# EAGLE design HeaterMeterPI (EAGLE 6.6.0)
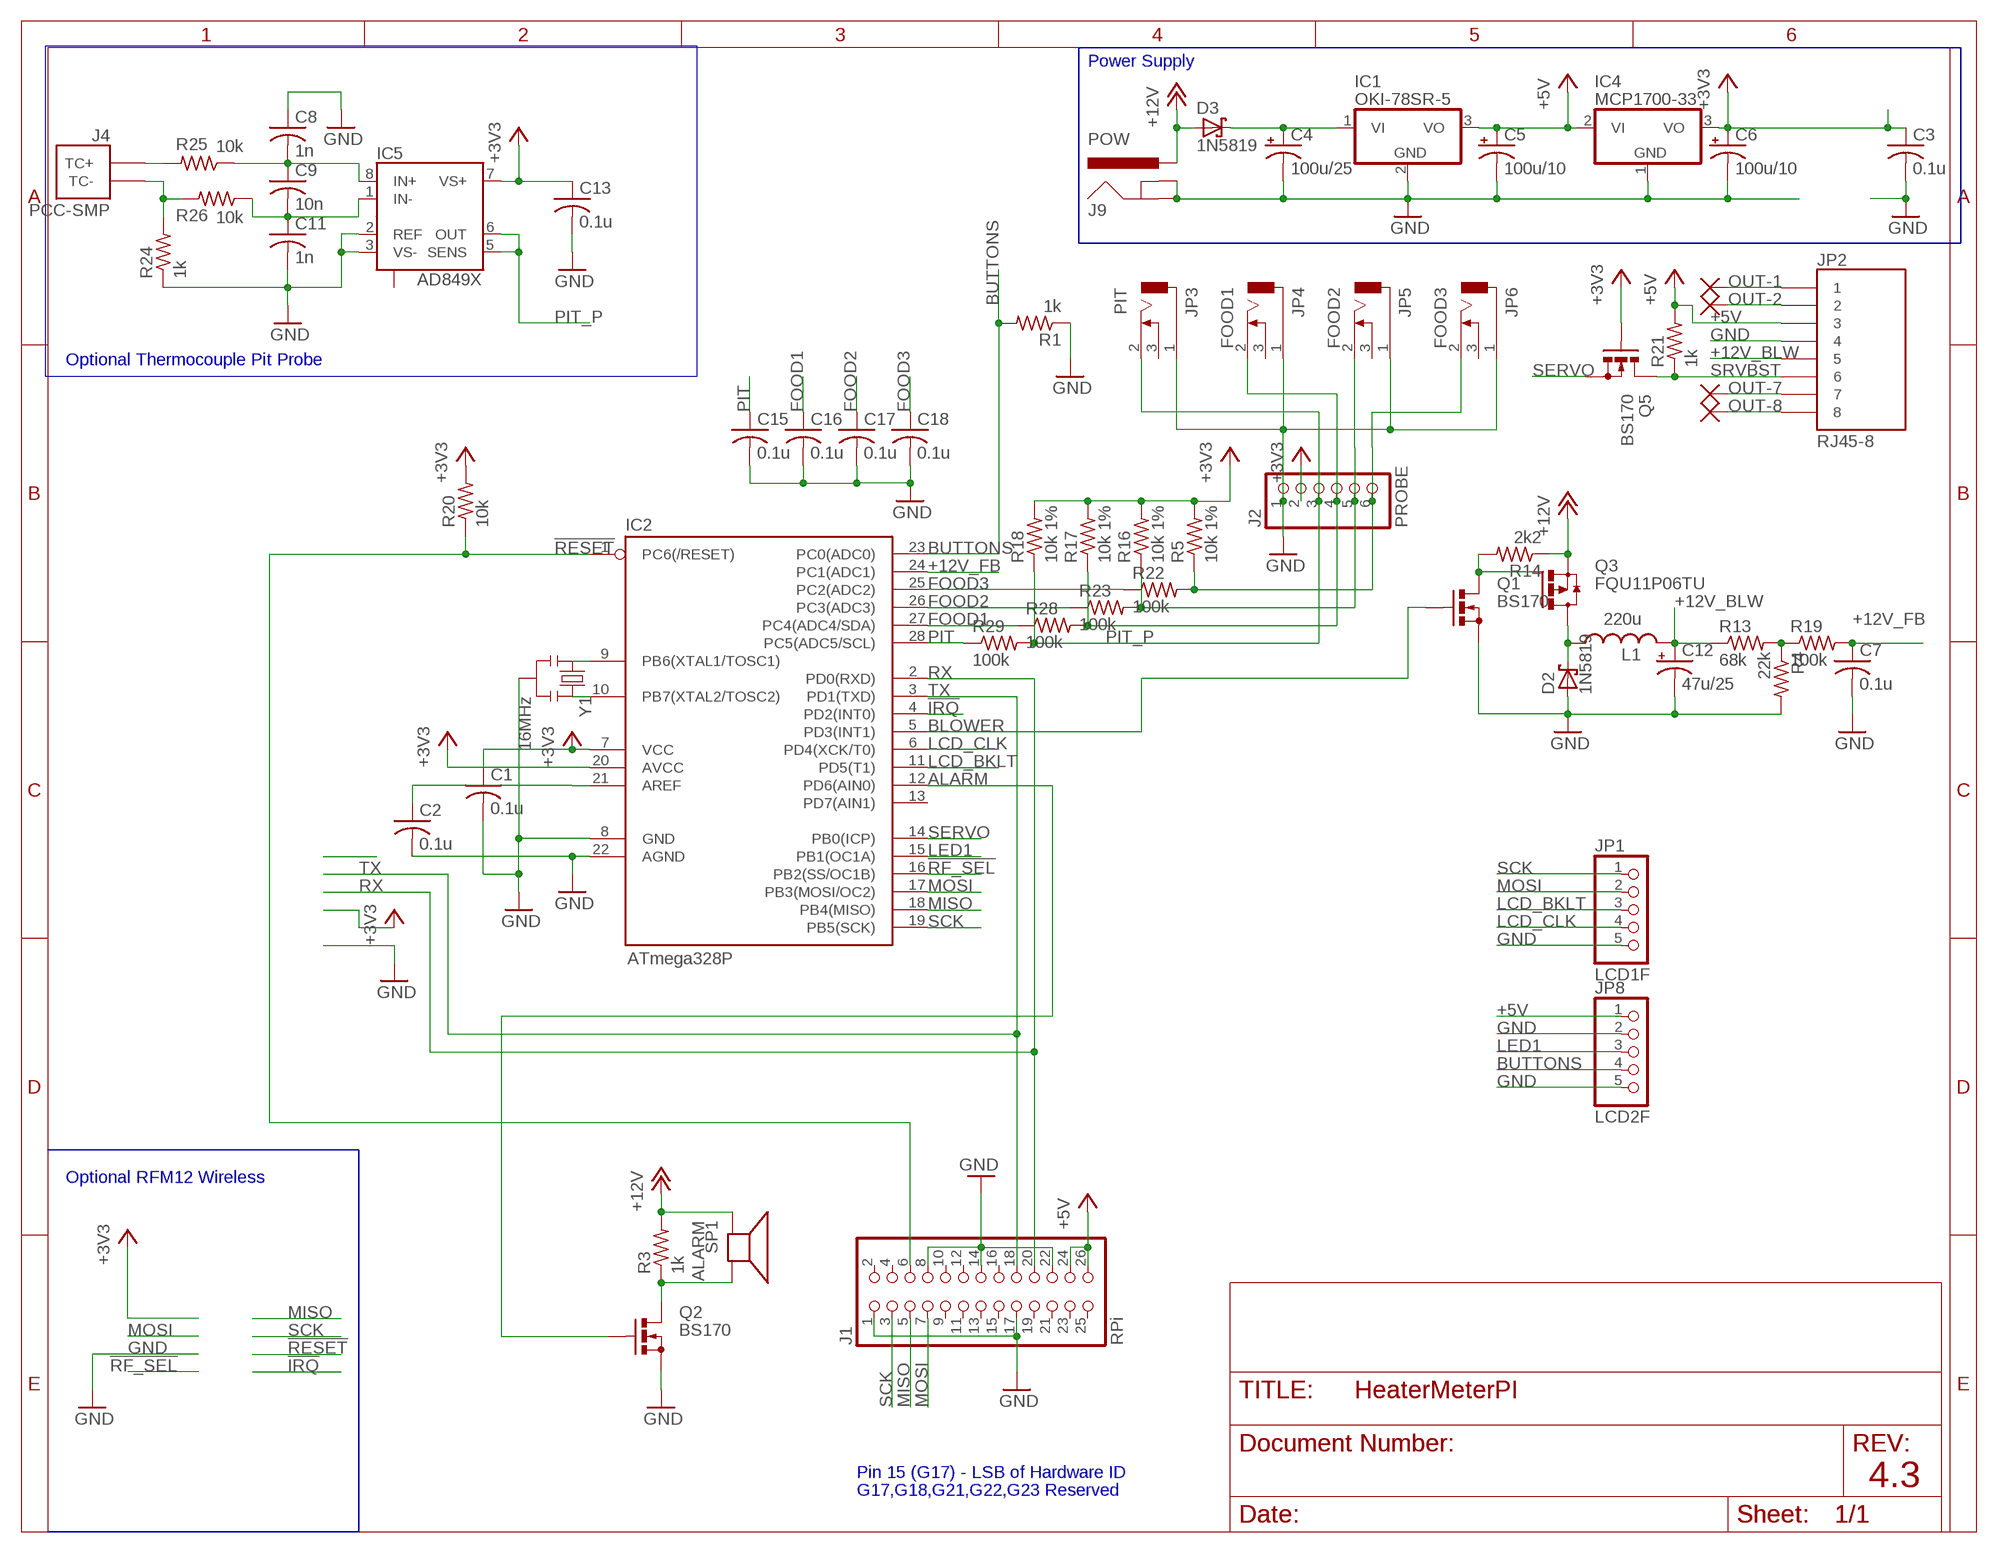
[diagram p0: schematic, sheet 1]

## Parts
C1  0.1u  C-US025-025X050  [C025-025X050]
C2  0.1u  C-US025-025X050  [C025-025X050]
C3  0.1u  C-US025-025X050  [C025-025X050]
C4  100u/25  CPOL-USE2.5-6  [E2,5-6]
C5  100u/10  CPOL-USE2.5-5  [E2,5-5]
C6  100u/10  CPOL-USE2.5-5  [E2,5-5]
C7  0.1u  C-US025-025X050  [C025-025X050]
C8  1n  C-USC0805  [C0805]
C9  10n  C-USC0805  [C0805]
C11  1n  C-USC0805  [C0805]
C12  47u/25  CPOL-USE2.5-5  [E2,5-5]
C13  0.1u  C-USC0805  [C0805]
C15  0.1u  C-US025-025X050  [C025-025X050]
C16  0.1u  C-US025-025X050  [C025-025X050]
C17  0.1u  C-US025-025X050  [C025-025X050]
C18  0.1u  C-US025-025X050  [C025-025X050]
D2  1N5819  [DO41-7]
D3  1N5819  [DO41-7]
IC1  OKI-78SR-5  OKI-78SR-05H  [TO220HMURATA]
IC2  ATmega328P  AVR-MEGA8-PPTH  [DIL28-3]
IC4  MCP1700-33  [TO92]
IC5  AD849X  [MSOP8]
J1  RPi  PINHD-2X13  [2X13]
J2  PROBE  PINHD-1X6  [1X06]
J4  PCC-SMP  THERMOCOUPLE  [PCC-SMP]
J9  POW  POWERJACKPTH  [BARREL-2.1]
JP1  LCD1F  PINHD-1X5  [1X05]
JP2  RJ45-8  [RJ45-8-1H]
JP3  PIT  AUDIO-MONOCUI  [CUI-MJ-2508]
JP4  FOOD1  AUDIO-MONOCUI  [CUI-MJ-2508]
JP5  FOOD2  AUDIO-MONOCUI  [CUI-MJ-2508]
JP6  FOOD3  AUDIO-MONOCUI  [CUI-MJ-2508]
JP8  LCD2F  PINHD-1X5  [1X05]
L1  220u  INDUCTOR9MM  [E5-9]
Q1  BS170  [SOT54E]
Q2  BS170  [SOT54E]
Q3  FQU11P06TU  MOSFET-P  [TO251]
Q5  BS170  [SOT54E]
R1  1k  R-US_0204/7  [0204/7]
R3  1k  R-US_0204/7  [0204/7]
R4  22k  R-US_0204/7  [0204/7]
R5  10k 1%  R-US_0207/2V  [0207/2V]
R13  68k  R-US_0204/7  [0204/7]
R14  2k2  R-US_0204/7  [0204/7]
R16  10k 1%  R-US_0207/2V  [0207/2V]
R17  10k 1%  R-US_0207/2V  [0207/2V]
R18  10k 1%  R-US_0207/2V  [0207/2V]
R19  100k  R-US_0204/7  [0204/7]
R20  10k  R-US_0204/7  [0204/7]
R21  1k  R-US_0204/7  [0204/7]
R22  100k  R-US_0207/2V  [0207/2V]
R23  100k  R-US_0207/2V  [0207/2V]
R24  1k  R-US_R0805  [R0805]
R25  10k  R-US_R0805  [R0805]
R26  10k  R-US_R0805  [R0805]
R28  100k  R-US_0207/2V  [0207/2V]
R29  100k  R-US_0207/2V  [0207/2V]
SP1  ALARM  SPEAKER/AL11P  [AL11P]
U$1  THROUGH-HOLE  [PAD-032]
U$2  THROUGH-HOLE  [PAD-032]
U$3  THROUGH-HOLE  [PAD-032]
U$4  THROUGH-HOLE  [PAD-032]
Y1  16MHz  RESONATORRESONATOR-PTH  [RESONATOR-PTH]

## Nets
!IRQ: IC2.4(PD2(INT0))
!RESET: IC2.1(PC6(/RESET)) J1.6 R20.1
!RF_SEL: IC2.16(PB2(SS/OC1B))
+3V3 [POW]: C1.1 C3.1 C6.+ C13.1 IC2.7(VCC) IC2.20(AVCC) IC4.3(VO) IC5.7(VS+) J2.2 Q5.G R5.2 R16.2 R17.2 R18.2 R20.2
+5V [POW]: C5.+ IC1.3(VO) IC4.2(VI) J1.24 J1.26 JP2.3 JP8.1 R21.2
+12V [HIGHPOW]: D3.A J9.PWR Q3.3(S) R3.2 R14.1 SP1.+
+12V_BLW [HIGHPOW]: C12.+ JP2.5 L1.NEG R13.1
+12V_FB: C7.1 IC2.24(PC1(ADC1)) R19.2
ALARM: IC2.12(PD6(AIN0)) Q2.G
BLOWER: IC2.5(PD3(INT1)) Q1.G
BUTTONS: IC2.23(PC0(ADC0)) JP8.4 R1.2
FOOD1: C16.1 IC2.27(PC4(ADC4/SDA)) R28.1
FOOD1_P: J2.4 JP4.2 R17.1 R28.2
FOOD2: C17.1 IC2.26(PC3(ADC3)) R23.1
FOOD2_P: J2.5 JP5.2 R16.1 R23.2
FOOD3: C18.1 IC2.25(PC2(ADC2)) R22.1
FOOD3_P: J2.6 JP6.2 R5.1 R22.2
GND [GND]: C1.2 C2.2 C3.2 C4.- C5.- C6.- C7.2 C8.1 C11.2 C12.- C13.2 C15.2 C16.2 C17.2 C18.2 D2.A IC1.2(GND) IC2.8(GND) IC2.22(AGND) IC4.1(GND) IC5.2(REF) IC5.3(VS-) J1.1 J1.8 J1.14 J1.17 J1.22 J2.1 J9.GND J9.GNDBREAK JP1.5 JP2.4 JP3.1 JP4.1 JP5.1 JP6.1 JP8.2 JP8.5 Q1.S Q2.S R1.1 R4.2 R24.1 Y1.2
LCD_BKLT: IC2.11(PD5(T1)) JP1.3
LCD_CLK: IC2.6(PD4(XCK/T0)) JP1.4
LED1: IC2.15(PB1(OC1A)) JP8.3
MISO: IC2.18(PB4(MISO)) J1.5
MOSI: IC2.17(PB3(MOSI/OC2)) J1.7 JP1.2
N$1: Q1.D Q3.1(G) R14.2
N$2: C2.1 IC2.21(AREF)
N$4 [HIGHPOW]: D2.C L1.POS Q3.2@1(D) Q3.2@2(D)
N$5: R4.1 R13.2 R19.1
N$9: Q2.D R3.1 SP1.-
N$13: IC2.10(PB7(XTAL2/TOSC2)) Y1.3
N$16: IC2.9(PB6(XTAL1/TOSC1)) Y1.1
N$27: J4.TC+ R25.2
N$28: J4.TC- R24.2 R26.2
OUT-1: JP2.1 U$3.P
OUT-2: JP2.2 U$4.P
OUT-7: JP2.7 U$2.P
OUT-8: JP2.8 U$1.P
PIT: C15.1 IC2.28(PC5(ADC5/SCL)) R29.1
PIT_P: IC5.5(SENS) IC5.6(OUT) J2.3 JP3.2 R18.1 R29.2
RX: IC2.2(PD0(RXD)) J1.20
SCK: IC2.19(PB5(SCK)) J1.3 JP1.1
SERVO: IC2.14(PB0(ICP)) Q5.S
SRVBST: JP2.6 Q5.D R21.1
TC+: C8.2 C9.1 IC5.8(IN+) R25.1
TC-: C9.2 C11.1 IC5.1(IN-) R26.1
TX: IC2.3(PD1(TXD)) J1.18
VRM_IN [HIGHPOW]: C4.+ D3.C IC1.1(VI)
Unconnected: IC2.13(PD7(AIN1)) IC5.4(NC) J1.2 J1.4 J1.9 J1.10 J1.11 J1.12 J1.13 J1.15 J1.16 J1.19 J1.21 J1.23 J1.25 JP3.3 JP4.3 JP5.3 JP6.3

## Buses
B$1
B$2
B$3

## Notes on the sheet
- Power Supply
- Optional Thermocouple Pit Probe
- Optional RFM12 Wireless
- Pin 15 (G17) - LSB of Hardware ID
- 4.3
- G17,G18,G21,G22,G23 Reserved

## Library data of the parts
C1-C3 C7-C9 C11 C13 C15-C18 = resistor:C-US: CAPACITOR, American symbol
C4-C6 C12 = resistor:CPOL-US: POLARIZED CAPACITOR, American symbol
D2 D3 = Bryan:1N5819
IC1 = Bryan:OKI-78SR-: Murata Power Solutions SIP DC/DC converter
IC2 = SparkFun:AVR-MEGA8-P: MICROCONTROLLER 8 Kbytes FLASH 1 kbytes SRAM 512 bytes EEPROM USART 4-channel 10 bit ADC 2-channel 8 bit ADC
IC4 = Bryan:MCP1700: MCP1700 Linear Voltage Regulator
IC5 = Bryan:AD849X: AD8494/AD8495/AD8496/AD8497 Precision Thermocouple Amplifiers with Cold Junction Compensation
J1 = pinhead:PINHD-2X13: PIN HEADER
J2 = pinhead:PINHD-1X6: PIN HEADER
J4 = Bryan:THERMOCOUPLE
J9 = Bryan:POWERJACK
JP1 JP8 = pinhead:PINHD-1X5: PIN HEADER
JP2 = Bryan:RJ45-8
JP3-JP6 = Bryan:AUDIO-MONO: 2.5mm mono headphone jack
L1 = Bryan:INDUCTOR
Q1 Q2 Q5 = transistor-small-signal:BS170: N-CHANNEL MOS FET
Q3 = Bryan:MOSFET-P
R1 R3-R5 R13 R14 R16-R26 R28 R29 = resistor:R-US_: RESISTOR, American symbol
SP1 = adafruit:SPEAKER: SPEAKER Source: Buerklin Added PS12 (for part # PS1240 piezo) http://www.ladyada.net/library/pcb/eaglelibrary.html
U$1-U$4 = Bryan:THROUGH-HOLE
Y1 = Bryan:RESONATOR

## Net classes
0 default: width 0.254 mm
1 POW: width 0.305 mm
2 HIGHPOW: width 0.406 mm
3 GND: width 0.406 mm

## Board
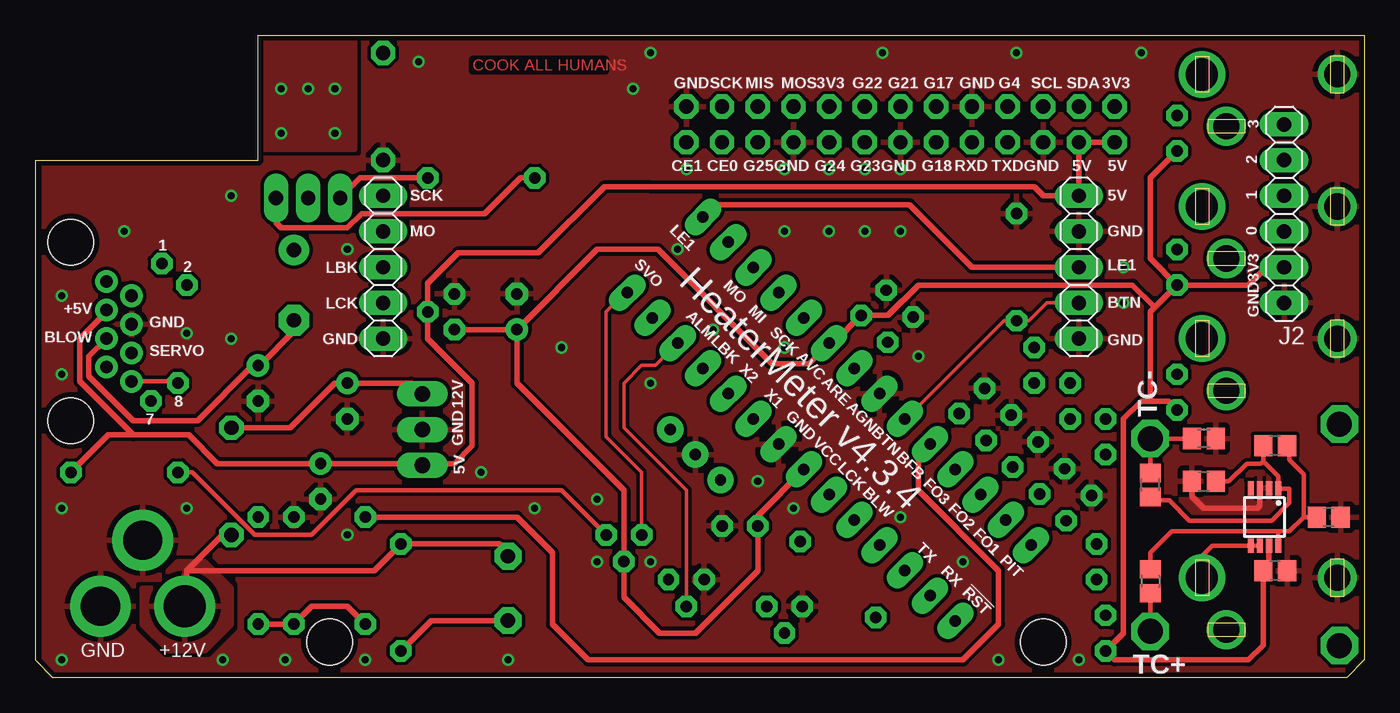
[diagram p1: board, top side]
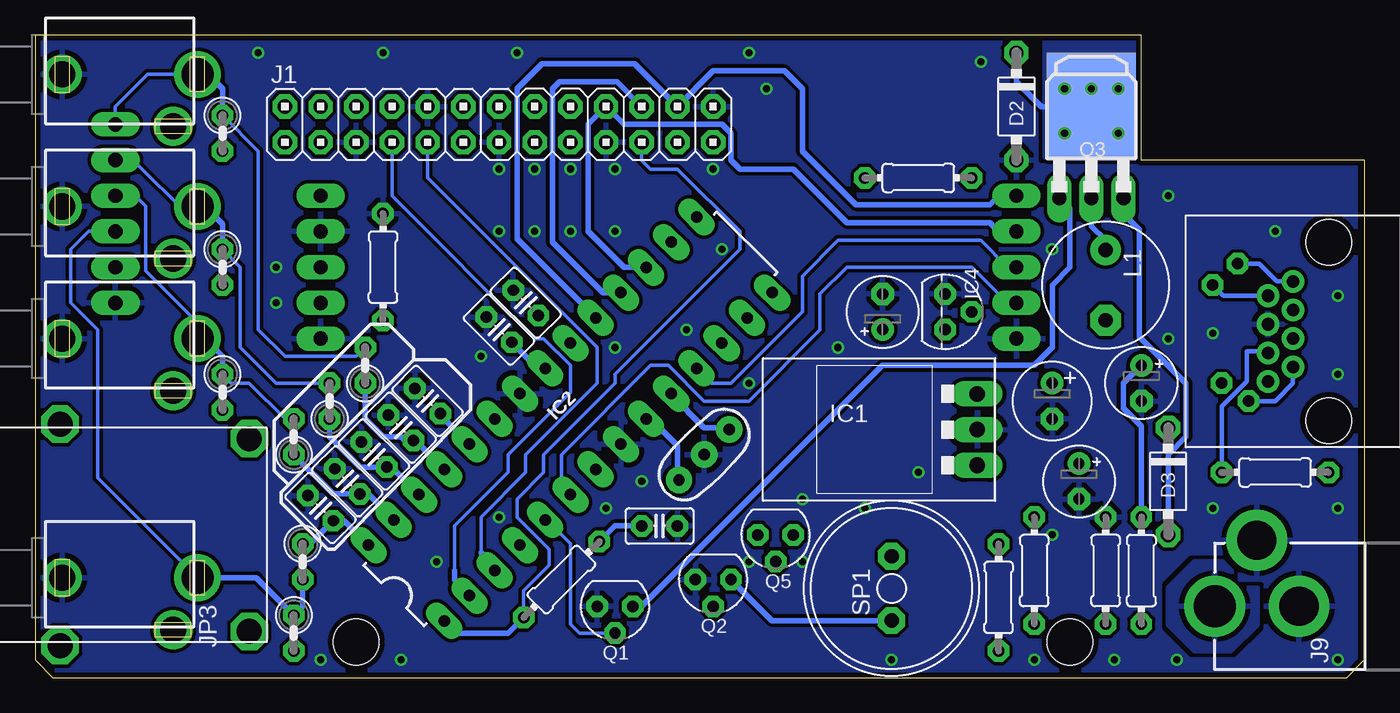
[diagram p2: board, bottom side, seen from below]

Size 94.62 x 45.72 mm. Coordinates in mm from the lower left corner, seen from the top.
Outline: 0,36.83 0,1.27 1.27,0 93.34,0 94.62,1.27 94.62,45.72 15.88,45.72 15.88,36.83 0,36.83
Copper layers (1*16): Top 0.0356mm / dielectric 1.5011mm / Bottom 0.0356mm
Design rules "LaenPCBOrder *": minimum track width 6mil, minimum drill 13mil, track to track 6mil, track to pad 6mil, pad to pad 6mil, via to via 6mil, smd to smd 6mil, copper to edge 15mil, drill to drill 6mil, minimum pad ring 14mil, minimum via ring 7mil, stop-mask expansion 3mil, vias tented up to drill 20mil, thermal gap 15mil
Holes 3.25 mm at 71.76,2.54 20.96,2.54

### Footprints (pad centres in the part's own frame; a part is rotated, then mirrored left to right if it is on the bottom)
C025-025X050 = drill 0.813 octagon: 1 -1.27,0; 2 1.27,0
E2,5-6 = drill 0.813 pad 1.6: + -1.27,0 | drill 0.813 pad 1.6 octagon: - 1.27,0
E2,5-5 = drill 0.813 pad 1.6: + -1.27,0 | drill 0.813 pad 1.6 octagon: - 1.27,0
C0805 = smd 1.3 x 1.5: 1 -0.85,0; 2 0.85,0
DO41-7 = drill 1.016 octagon: A 3.81,0; C -3.81,0
TO220HMURATA = drill 1.118 long: 1 2.54,-5.08; 2 0,-5.08; 3 -2.54,-5.08
DIL28-3 = drill 0.813 long: 1 -16.51,-3.81; 2 -13.97,-3.81; 3 -11.43,-3.81; 4 -8.89,-3.81; 5 -6.35,-3.81; 6 -3.81,-3.81; 7 -1.27,-3.81; 8 1.27,-3.81; 9 3.81,-3.81; 10 6.35,-3.81; 11 8.89,-3.81; 12 11.43,-3.81; 13 13.97,-3.81; 14 16.51,-3.81; 15 16.51,3.81; 16 13.97,3.81; 17 11.43,3.81; 18 8.89,3.81; 19 6.35,3.81; 20 3.81,3.81; 21 1.27,3.81; 22 -1.27,3.81; 23 -3.81,3.81; 24 -6.35,3.81; 25 -8.89,3.81; 26 -11.43,3.81; 27 -13.97,3.81; 28 -16.51,3.81
TO92 = drill 0.813 octagon: 1 -1.27,0; 2 0,1.905; 3 1.27,0
MSOP8 = smd 0.43 x 1: 1 -0.975,-2.05; 2 -0.325,-2.05; 3 0.325,-2.05; 4 0.975,-2.05; 5 0.975,2.05; 6 0.325,2.05; 7 -0.325,2.05; 8 -0.975,2.05
2X13 = drill 1.016 octagon: 1 -15.24,-1.27; 2 -15.24,1.27; 3 -12.7,-1.27; 4 -12.7,1.27; 5 -10.16,-1.27; 6 -10.16,1.27; 7 -7.62,-1.27; 8 -7.62,1.27; 9 -5.08,-1.27; 10 -5.08,1.27; 11 -2.54,-1.27; 12 -2.54,1.27; 13 0,-1.27; 14 0,1.27; 15 2.54,-1.27; 16 2.54,1.27; 17 5.08,-1.27; 18 5.08,1.27; 19 7.62,-1.27; 20 7.62,1.27; 21 10.16,-1.27; 22 10.16,1.27; 23 12.7,-1.27; 24 12.7,1.27; 25 15.24,-1.27; 26 15.24,1.27
1X06 = drill 1.016 long: 1 -6.35,0; 2 -3.81,0; 3 -1.27,0; 4 1.27,0; 5 3.81,0; 6 6.35,0
PCC-SMP = drill 1.778 octagon: P$3 7.874,13.462; P$4 -7.874,13.462; TC+ -6.858,0; TC- 6.858,0
BARREL-2.1 = drill 2.8 pad 4.318: GND 0,7.7; GNDBREAK 4.7,10.7 | drill 2.997 pad 4.318: PWR 0,13.7
1X05 = drill 1.016 long: 1 -5.08,0; 2 -2.54,0; 3 0,0; 4 2.54,0; 5 5.08,0
RJ45-8-1H = drill 0.9: 1 9.906,2.54; 2 8.89,4.318; 3 7.874,2.54; 4 6.858,4.318; 5 5.842,2.54; 6 4.826,4.318; 7 3.81,2.54; 8 2.794,4.318 | hole 3.251: 0,0; 12.7,0
CUI-MJ-2508 = drill 1.854: 1 0,-4.43; 3 3.7,3.47 | drill 2.3: 2 0,5.216
E5-9 = drill 1.016 pad 2.184 octagon: NEG 2.5,0 | drill 1.016 pad 2.184: POS -2.5,0
SOT54E = drill 0.813 octagon: D -1.27,0; G 0,1.905; S 1.27,0
TO251 = drill 1.016 pad 1.524 long: 1 -2.286,-2.699; 3 2.286,-2.699 | drill 1.016 pad 1.27 long: 2@1 0,-2.699 | smd 6.35 x 7.62: 2@2 0,3.81
0204/7 = drill 0.813 octagon: 1 -3.81,0; 2 3.81,0
0207/2V = drill 0.813 octagon: 1 -1.27,0; 2 1.27,0
R0805 = smd 1.3 x 1.5: 1 -0.85,0; 2 0.85,0
AL11P = drill 1.016 pad 1.905 octagon: + 2.286,0; - -2.286,0
PAD-032 = drill 0.813 octagon: P 0,0
RESONATOR-PTH = drill 0.813 pad 1.88: 1 -2.54,0; 2 0,0; 3 2.54,0

### Placement (x,y rotation side)
C1  50.16,10.79 0 bottom
C2  61.59,24.77 135 bottom
C3  59.69,26.67 135 bottom
C4  22.23,19.68 270 bottom
C5  20.32,13.97 270 bottom
C6  34.29,26.04 90 bottom
C7  66.68,19.68 135 bottom
C8  92.08,11.43 180 top
C9  88.27,16.51 180 top
C11  83.19,13.97 180 top
C12  15.88,20.95 270 bottom
C13  88.27,7.62 0 top
C15  74.3,12.06 135 bottom
C16  72.39,13.97 135 bottom
C17  70.48,15.88 135 bottom
C18  68.58,17.78 135 bottom
D2  24.77,40.64 270 bottom
D3  13.97,13.97 270 bottom
IC1  32.64,17.65 90 bottom
IC2  56.52,18.41 45 bottom
IC4  29.85,26.04 270 bottom
IC5  87.5,11.43 180 top
J1  61.59,39.37 180 bottom
J2  88.9,33.02 90 top
J4  79.38,10.16 90 bottom
J9  -3.05,5.08 90 bottom
JP1  24.77,29.21 270 top
JP2  2.54,18.29 90 bottom
JP3  88.27,7.11 270 bottom
JP4  88.27,24.13 270 bottom
JP5  88.27,33.53 270 bottom
JP6  88.27,42.93 270 bottom
JP8  74.3,29.21 270 top
L1  18.42,27.94 270 bottom
Q1  53.34,5.08 180 bottom
Q2  46.35,6.99 180 bottom
Q3  19.43,36.83 0 bottom
Q5  41.91,10.16 180 bottom
R1  69.85,29.21 270 bottom
R3  26.04,5.71 90 bottom
R4  18.42,7.62 90 bottom
R5  81.28,38.73 270 bottom
R13  15.88,7.62 270 bottom
R14  31.75,35.56 0 bottom
R16  81.28,29.21 270 bottom
R17  81.28,20.32 270 bottom
R18  76.2,3.17 270 bottom
R19  23.5,7.62 90 bottom
R20  57.15,6.99 45 bottom
R21  6.35,14.61 0 bottom
R22  71.12,22.23 90 bottom
R23  73.66,19.68 90 bottom
R24  83.19,17.02 180 top
R25  79.38,6.86 270 top
R26  79.38,13.72 90 top
R28  76.2,17.14 90 bottom
R29  75.57,8.26 270 bottom
SP1  33.66,6.35 90 bottom
U$1  10.16,20.95 0 top
U$2  8.26,19.68 0 top
U$3  9.02,29.46 0 top
U$4  10.79,27.94 0 top
Y1  46.99,15.88 45 bottom

### Tracks (layer width: path | path; a pad name or v marks a point on that pad's centre or on a via)
!RESET
  Bottom 0.254: J1.6 51.43,36.83 50.8,36.2 48.89,36.2 44.45,31.75 44.45,30.48 53.34,21.59 53.34,20.95 58.42,15.88 58.42,14.61 60.32,12.7 60.32,11.43 58.04,9.14 58.04,8 59.84,6.2 R20.1
  Bottom 0.406: IC2.1 65.5,3.9 64.77,3.17 60.96,3.17 R20.1
+3V3
  Top 0.305: 87.83,8.03 C13.1
  Top 0.381: IC5.7 87.83,8.03
  Top 0.406: IC2.7 51.43,11.54 C1.1 51.43,7.62 46.99,3.17 44.45,3.17 41.91,5.71 Q5.G 41.91,13.34 34.29,20.95 C6.+ | IC4.3 C6.+ | C6.+ 40,30.48 44.32,30.48 52.45,22.35 55.06,22.35 IC2.20 56.82,23.8 C3.1 60.7,25.77 62.86,27.94 78.11,27.94 79.69,26.35 | 79.38,19.68 78.74,19.68 77.47,18.41 77.47,3.17 R18.2 76.84,1.27 86.36,1.27 87.42,2.33 C13.1 | 79.38,19.68 80.65,19.68 R17.2 | R16.2 79.69,26.35 | 79.69,26.35 79.38,26.04 79.38,19.68 | R5.2 79.38,35.56 79.38,29.84 R16.2 | J2.2 87.63,29.21 86.36,27.94 R16.2
  Bottom 0.406: C1.1 53.34,10.79 R20.2
+5V
  Top 0.406: J1.26 J1.24 JP8.1 71.76,34.29 71.12,34.92 43.81,34.92 40.51,34.92 35.81,30.23 30.1,30.23 27.94,28.07 IC4.2 27.94,24.13 31.12,20.95 31.12,16.51 29.85,15.24 27.69,15.24 IC1.3 27.43,15.24 C5.+ 12.95,15.24 10.92,17.27 6.98,17.27 | JP2.3 5.08,26.04 3.17,24.13 3.17,21.08 6.98,17.27 | 6.98,17.27 5.21,17.27 R21.2
+12V
  Top 0.406: SP1.+ 33.66,8.89 33.02,9.53 R3.2 24.13,7.62 10.79,7.62 | 10.79,7.62 10.79,5.22 J9.PWR | D3.A 13.33,10.16 10.79,7.62 | R14.1 34.54,35.56 32,33.02 23.24,33.02 22.23,32 17.53,32 17.15,32.38 Q3.3
  Bottom 0.406: D3.A 13.97,15.88 12.7,17.14 12.7,20.95 16,24.26 16,31.11 16,31.88 17.15,33.02 Q3.3
  pour Bottom: 7.62,6.35 8.26,6.35 10.16,8.26 12.06,8.26 13.97,6.35 13.97,3.81 12.06,1.91 9.53,1.91 7.62,3.81
  pour Top (isolate 0.254): 7.62,6.35 8.26,6.35 10.16,8.26 12.06,8.26 13.97,6.35 13.97,3.81 12.06,1.91 9.53,1.91 7.62,3.81
+12V_BLW
  Top 0.406: 6.98,18.29 6.73,18.54 | 6.73,18.54 3.81,21.46 3.81,22.86 JP2.5 | L1.NEG 18.42,24.64 16,22.23 C12.+ 15.49,22.23 11.56,18.29 6.98,18.29 | 6.98,18.29 6.73,18.54
  Bottom 0.406: R13.1 15.88,17.4 15.88,17.91 17.15,19.18 17.15,20.95 C12.+
+12V_FB
  Top 0.406: IC2.24 62.86,15.79 62.86,13.34 68.58,7.62 68.58,3.81 66.04,1.27 39.37,1.27 36.83,3.81 36.83,8.89 34.29,11.43 R19.2
  Bottom 0.406: C7.1 65.78,18.7 IC2.24 63.7,16.07 63.5,15.88
ALARM
  Top 0.254: IC2.12 44.16,22.23 43.18,22.23 41.91,20.95 41.91,17.78 46.35,13.34 Q2.G
BLOWER
  Bottom 0.254: IC2.5 58.22,11.23 56.52,9.53 56.52,3.81 55.88,3.17 Q1.G
BUTTONS
  Top 0.254: IC2.23 61.98,18.41 68.96,25.4 R1.2 70.74,25.4 72.01,26.67 JP8.4
FOOD1
  Bottom 0.406: IC2.27 70.93,13.07 C16.1 73.4,13.07 R28.1
FOOD1_P
  Bottom 0.254: R28.2 76.84,18.41 79.38,20.95 80.65,20.95 R17.1 | JP4.2 83.05,25.26 86.74,28.96 86.74,33.53 87.5,34.29 J2.4
  Bottom 0.406: R17.1 81.28,22.86 82.55,24.13 JP4.2
FOOD2
  Bottom 0.406: IC2.26 69.24,14.98 C17.1 71.49,14.98 73.66,17.14 R23.1
FOOD2_P
  Bottom 0.254: JP5.2 84.33,33.53 87,36.2 87.63,36.83 J2.5 | R23.2 77.47,20.95 80.01,23.5 80.01,29.21 R16.1
  Bottom 0.406: JP5.2 82.55,33.53 | 82.55,33.53 82.42,33.53 | R16.1 81.28,32.26 82.55,33.53
FOOD3
  Bottom 0.406: IC2.25 67.55,16.88 C18.1 68.32,16.88 68.58,17.14 69.85,17.14 71.12,18.41 R22.1
FOOD3_P
  Bottom 0.254: JP6.2 84.71,42.93 86.61,42.93 88.9,40.64 88.9,40.26 J2.6 | R5.1 78.74,37.47 78.74,24.77 76.84,22.86 71.76,22.86 R22.2
  Bottom 0.406: JP6.2 82.3,42.93 81.28,41.91 R5.1
GND  (via drill 0.5)
  Top 0.406: IC5.3 87.18,12.25 87,12.06 83.19,12.06 82.34,12.91 C11.2
  other vias: 37.46,23.5 10.79,24.51 43.81,20.95 53.34,23.5 45.72,30.48 61.59,31.75 59.05,31.75 56.52,31.75 53.34,31.75 66.04,8.26 42.54,41.91 53.98,12.06 51.43,13.97 48.26,24.77 53.34,36.2 56.52,36.2 59.05,36.2 61.59,36.2 6.35,31.75 1.91,27.18 1.91,21.59 1.91,12.06 13.33,1.27 23.5,1.27 33.66,1.27 17.78,1.27 68.58,1.27 74.3,1.27 1.91,1.27 10.79,12.06 43.81,44.45 60.32,44.45 69.85,44.45 78.74,44.45 62.86,22.86 61.59,11.43 46.35,36.2 13.97,34.29 27.31,43.81 40,8.26 43.81,8.26 40,12.7 22.23,10.16 35.56,12.06 31.75,14.61 22.23,30.48 77.47,29.21 77.47,26.67 13.97,24.13
  pour Bottom (isolate 0.254, rank 2): 0.64,0 0.64,45.72 94.62,45.72 94.62,0
  pour Top (isolate 0.254, rank 2): 0.64,0 0.64,45.72 94.62,45.72 94.62,0
LCD_BKLT
  Bottom 0.254: JP1.3 25.4,29.21 27.31,31.11 37.46,31.11 40,28.57 40,26.04 45.09,20.95 46.48,20.95 IC2.11
LCD_CLK
  Bottom 0.254: IC2.6 56.52,13.34 57.15,13.97 57.15,15.88 50.8,22.23 49.53,22.23 46.99,19.68 43.81,19.68 38.73,24.77 38.73,27.3 36.83,29.21 27.94,29.21 25.4,26.67 JP1.4
LED1
  Top 0.406: 47.53,32.93 IC2.15 48.41,33.66 62.23,33.66 66.68,29.21 JP8.3
MISO
  Bottom 0.406: IC2.18 54.19,27.39 57.78,30.99 57.78,41.91 57.28,42.42 53.21,42.42 J1.5
MOSI
  Bottom 0.406: JP1.2 26.04,31.75 26.67,32.38 36.83,32.38 40.64,36.2 44.45,36.2 45.09,36.83 45.09,38.73 45.72,39.37 52.7,39.37 J1.7 55.24,39.37 55.24,31.75 52.69,29.19 IC2.17
N$1
  Top 0.406: R14.2 23.15,35.56 Q3.1
  Bottom 0.406: Q1.D 51.43,5.08 34.29,22.23 23.5,22.23 22.23,23.5 22.23,27.94 20.96,29.21 20.96,33.37 Q3.1
N$2
  Bottom 0.406: IC2.21 58.84,22.01 C2.1
N$4  (via drill 0.5)
  Bottom 0.406: L1.POS 18.42,31.11 19.43,32.13 Q3.2@1 Q3.2@2 22.99,40.64 24.77,42.42 D2.C
  other vias: 17.53,38.73 21.34,38.73 21.34,41.91 19.43,41.91 17.53,41.91
  pour Top: 15.88,37.59 15.88,45.72 22.73,45.72 22.73,37.59
  pour Bottom: 15.88,37.08 15.88,45.72 22.73,45.72 22.73,37.08
N$5
  Top 0.406: R13.2 R4.1 19.69,5.08 22.23,5.08 R19.1
N$9
  Top 0.406: SP1.- 28.19,4.06 R3.1
  Bottom 0.406: SP1.- 42.16,4.06 Q2.D
N$13
  Bottom 0.406: IC2.10 49.33,20.12 46.99,17.78 45.3,17.78 Y1.3
N$16
  Bottom 0.406: IC2.9 50.8,18.41 48.89,16.51 48.89,14.19 Y1.1
N$27
  Top 0.305: J4.TC+ R25.2
N$28
  Top 0.305: R26.2 J4.TC- 80.9,17.02 R24.2
OUT-1
  Bottom 0.305: JP2.1 6.22,28.19 7.49,29.46 U$3.P
OUT-2
  Bottom 0.305: JP2.2 10.03,27.18 U$4.P
OUT-7
  Bottom 0.305: JP2.7 5.08,20.95 6.35,19.68 U$2.P
OUT-8
  Top 0.305: JP2.8 10.03,21.08 U$1.P
PIT
  Bottom 0.406: R29.1 75.04,9.53 C15.1 72.62,11.17 IC2.28
PIT_P
  Top 0.305: IC5.6 IC5.5 83.79,9.38 83.05,8.64 JP3.2
  Bottom 0.254: JP3.2 90.17,14.23 90.17,24.77 92.08,26.67 92.08,30.48 90.81,31.75 89.15,31.75 J2.3
  Bottom 0.406: R29.2 75.57,5.08 R18.1 78.87,7.11 JP3.2
RX
  Bottom 0.254: J1.20 69.22,34.29 59.05,24.13 58.42,24.13 56.52,22.23 56.52,20.32 60.96,15.88 60.96,14.61 64.77,10.79 64.77,7.62
  Bottom 0.406: IC2.2 63.7,5.91 64.77,6.99 64.77,7.62
SCK
  Bottom 0.406: JP1.1 26.04,34.29 26.67,33.66 36.2,33.66 40,37.47 40,41.91 41.27,43.18 46.35,43.18 J1.3 51.94,43.69 58.55,43.69 60.32,41.91 60.32,31.24 54.72,25.64 IC2.19
SERVO
  Top 0.254: IC2.14 42,27.39 40.64,26.04 40.64,17.14 43.18,14.61 Q5.S
SRVBST
  Top 0.305: Q5.D 37.46,13.34 22.86,13.34 19.69,10.16 15.62,10.16 11.18,14.61 R21.1
  Bottom 0.305: JP2.6 6.98,23.24 8.38,23.24 8.38,21.08 10.16,19.3 R21.1
TC+
  Top 0.305: R25.1 79.38,8.89 80.9,10.41 88.52,10.41 | 88.52,10.41 89.28,10.41 90.3,11.43 | 90.3,11.43 C8.2 | 90.3,11.43 90.3,14.48 89.28,15.49 89.28,16.34 C9.1 | IC5.8 88.48,10.37 88.52,10.41
TC-
  Top 0.305: C11.1 84.96,13.97 86.23,15.24 87.25,15.24 87.42,15.41 | C9.2 87.42,15.41 | 87.42,15.41 88.48,14.34 IC5.1 88.52,13.44 89.28,13.44 89.28,12.45 88.01,11.18 82.17,11.18 80.73,12.61 79.38,12.61 R26.1
TX
  Bottom 0.254: J1.18 66.68,35.56 54.61,23.5 54.61,20.95 59.69,15.88 59.69,14.61 62.86,11.43 62.86,8.89
  Bottom 0.406: IC2.3 62.23,7.97 62.23,8.26 62.86,8.89
VRM_IN
  Top 0.406: D3.C 18.16,17.78 21.34,20.95 C4.+ 26.8,20.95 IC1.1

### Text on the board
Top: COOK ALL HUMANS
bValues: 10k | 10k | 100k | 10k | 100k | 10k
_tsilk: GND | SCK | MIS | MOS | 3V3 | G22 | G21 | G17 | GND | G4 | SCL | SDA | 3V3 | 3 | CE1 | CE0 | G25 | GND | G24 | G23 | GND | G18 | RXD | TXD | GND | 5V | 5V | 2 | SCK | 5V | 1 | LE1 | MO | GND | 0 | 1 | LBK | 2 | SVO | LE1 | HeaterMeter v4.3.4 | MO | 3V3 | +5V | LCK | ALM | MI | BTN | GND | BLOW | GND | GND | SCK | LBK | GND | SERVO | AVC | X2 | ARE | 8 | X1 | 7 | 12V | GND | AGN | TC- | GND | VCC | BTN | BFB | LCK | 5V | FO3 | BLW | FO2 | FO1 | TX | PIT | RX | !RST | GND | +12V | TC+